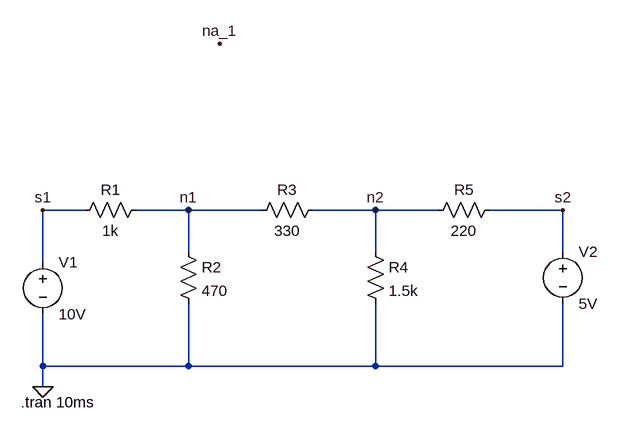
[diagram p0: schematic Draft1.asc]
Draft1.asc, the LTspice schematic file:
Version 4
SHEET 1 880 680
WIRE 64 192 0 192
WIRE 224 192 144 192
WIRE 336 192 224 192
WIRE 512 192 416 192
WIRE 608 192 512 192
WIRE 800 192 688 192
WIRE 224 256 224 192
WIRE 512 256 512 192
WIRE 800 256 800 192
WIRE 0 272 0 192
WIRE 0 432 0 352
WIRE 224 432 224 336
WIRE 224 432 0 432
WIRE 512 432 512 336
WIRE 512 432 224 432
WIRE 800 432 800 336
WIRE 800 432 512 432
WIRE 0 464 0 432
FLAG 0 464 0
FLAG 0 192 s1
FLAG 224 192 n1
FLAG 512 192 n2
FLAG 800 192 s2
FLAG 272 -64 na_1
SYMBOL res 160 176 R90
WINDOW 0 0 56 VBottom 2
WINDOW 3 32 56 VTop 2
SYMATTR InstName R1
SYMATTR Value 1k
SYMBOL voltage 0 256 R0
SYMATTR InstName V1
SYMATTR Value 10V
SYMBOL voltage 800 240 R0
SYMATTR InstName V2
SYMATTR Value 5V
SYMBOL res 208 240 R0
SYMATTR InstName R2
SYMATTR Value 470
SYMBOL res 432 176 R90
WINDOW 0 0 56 VBottom 2
WINDOW 3 32 56 VTop 2
SYMATTR InstName R3
SYMATTR Value 330
SYMBOL res 496 240 R0
SYMATTR InstName R4
SYMATTR Value 1.5k
SYMBOL res 704 176 R90
WINDOW 0 0 56 VBottom 2
WINDOW 3 32 56 VTop 2
SYMATTR InstName R5
SYMATTR Value 220
TEXT -34 488 Left 2 !.tran 10ms

The netlist it stands for:
* Draft1.asc
R1 n1 s1 1k
V1 s1 0 10V
V2 s2 0 5V
R2 n1 0 470
R3 n2 n1 330
R4 n2 0 1.5k
R5 s2 n2 220
.tran 10ms
.backanno
.end